# Altium schematic sheet 05_BANK_5_6.SchDoc
size OrCAD B
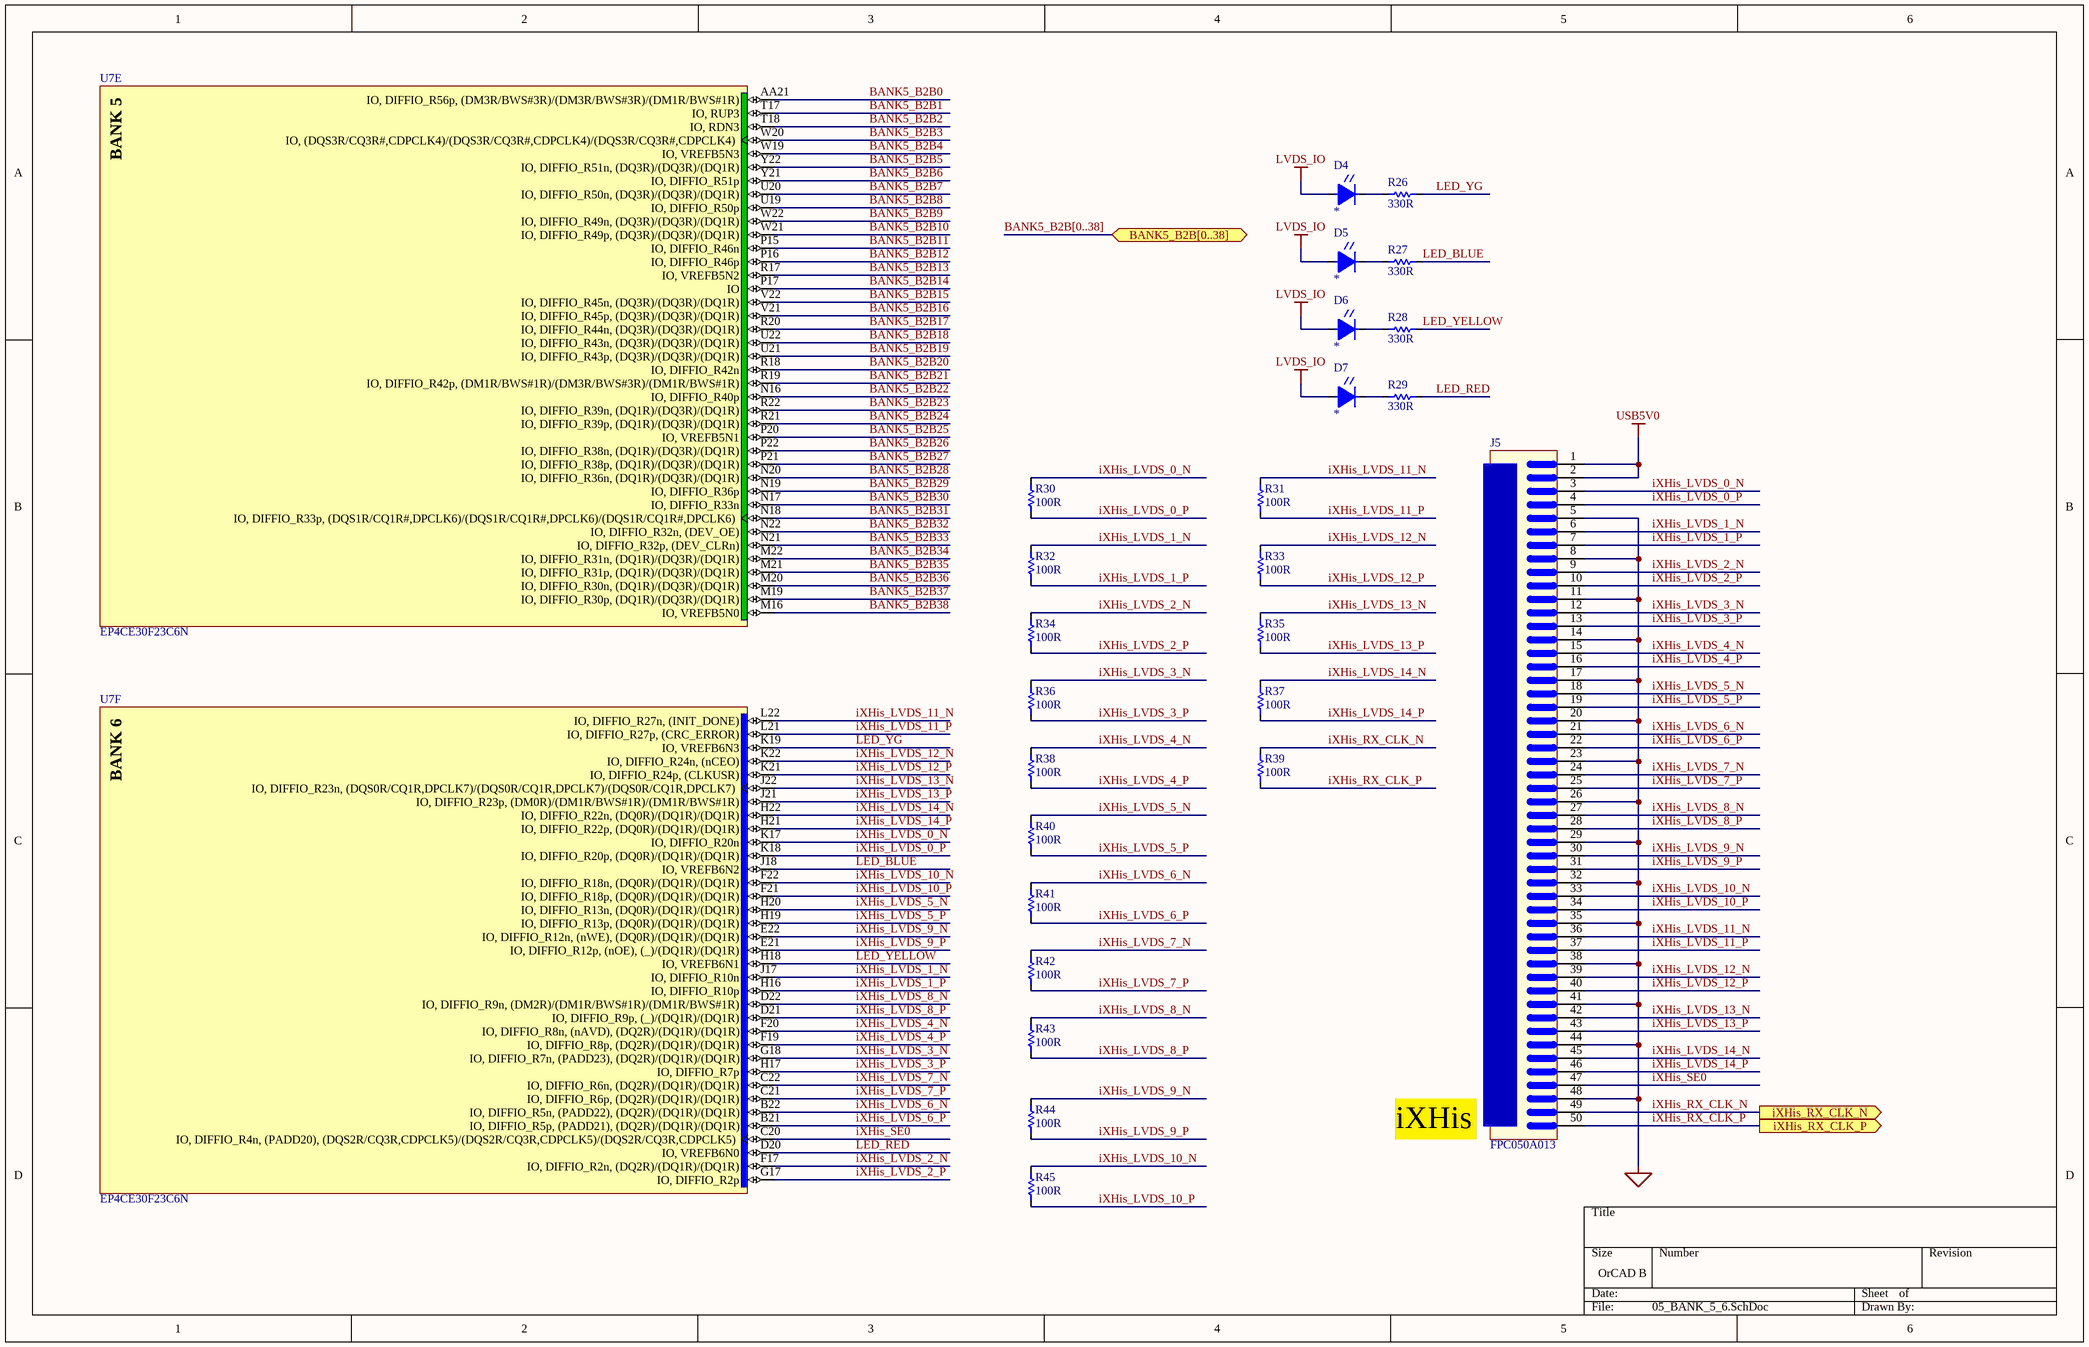
[diagram p0: 05_BANK_5_6.SchDoc]

## Parts
D4  *  [LED0603]
D5  *  [LED0603]
D6  *  [LED0603]
D7  *  [LED0603]
J5  FPC050A013  [FPC050A013]
R26  330R  [R0402]
R27  330R  [R0402]
R28  330R  [R0402]
R29  330R  [R0402]
R30  100R  [R0402]
R31  100R  [R0402]
R32  100R  [R0402]
R33  100R  [R0402]
R34  100R  [R0402]
R35  100R  [R0402]
R36  100R  [R0402]
R37  100R  [R0402]
R38  100R  [R0402]
R39  100R  [R0402]
R40  100R  [R0402]
R41  100R  [R0402]
R42  100R  [R0402]
R43  100R  [R0402]
R44  100R  [R0402]
R45  100R  [R0402]
U7  EP4CE30F23C6N  [FBGA484_EP4CE30F23C6N]  (parts E,F of 13)

## Ports
BANK5_B2B[0..38] (bidir), iXHis_RX_CLK_N (out), iXHis_RX_CLK_P (out)

## Nets
GND: J5.5 J5.8 J5.11 J5.14 J5.17 J5.20 J5.23 J5.26 J5.29 J5.32 J5.35 J5.38 J5.41 J5.44 J5.48
LVDS_IO: D4.1(L20) D5.1(L20) D6.1(L20) D7.1(L20)
USB5V0: J5.1 J5.2
BANK5_B2B0: U7.AA21(IO,_DIFFIO_R56p,_(DM3R/BWS#3R)/(DM3R/BWS#3R)/(DM1R/BWS#1R))
BANK5_B2B1: U7.T17(IO,_RUP3)
BANK5_B2B2: U7.T18(IO,_RDN3)
BANK5_B2B3: U7.W20(IO,_(DQS3R/CQ3R#,CDPCLK4)/(DQS3R/CQ3R#,CDPCLK4)/(DQS3R/CQ3R#,CDPCLK4))
BANK5_B2B4: U7.W19(IO,_VREFB5N3)
BANK5_B2B5: U7.Y22(IO,_DIFFIO_R51n,_(DQ3R)/(DQ3R)/(DQ1R))
BANK5_B2B6: U7.Y21(IO,_DIFFIO_R51p)
BANK5_B2B7: U7.U20(IO,_DIFFIO_R50n,_(DQ3R)/(DQ3R)/(DQ1R))
BANK5_B2B8: U7.U19(IO,_DIFFIO_R50p)
BANK5_B2B9: U7.W22(IO,_DIFFIO_R49n,_(DQ3R)/(DQ3R)/(DQ1R))
BANK5_B2B10: U7.W21(IO,_DIFFIO_R49p,_(DQ3R)/(DQ3R)/(DQ1R))
BANK5_B2B11: U7.P15(IO,_DIFFIO_R46n)
BANK5_B2B12: U7.P16(IO,_DIFFIO_R46p)
BANK5_B2B13: U7.R17(IO,_VREFB5N2)
BANK5_B2B14: U7.P17(IO)
BANK5_B2B15: U7.V22(IO,_DIFFIO_R45n,_(DQ3R)/(DQ3R)/(DQ1R))
BANK5_B2B16: U7.V21(IO,_DIFFIO_R45p,_(DQ3R)/(DQ3R)/(DQ1R))
BANK5_B2B17: U7.R20(IO,_DIFFIO_R44n,_(DQ3R)/(DQ3R)/(DQ1R))
BANK5_B2B18: U7.U22(IO,_DIFFIO_R43n,_(DQ3R)/(DQ3R)/(DQ1R))
BANK5_B2B19: U7.U21(IO,_DIFFIO_R43p,_(DQ3R)/(DQ3R)/(DQ1R))
BANK5_B2B20: U7.R18(IO,_DIFFIO_R42n)
BANK5_B2B21: U7.R19(IO,_DIFFIO_R42p,_(DM1R/BWS#1R)/(DM3R/BWS#3R)/(DM1R/BWS#1R))
BANK5_B2B22: U7.N16(IO,_DIFFIO_R40p)
BANK5_B2B23: U7.R22(IO,_DIFFIO_R39n,_(DQ1R)/(DQ3R)/(DQ1R))
BANK5_B2B24: U7.R21(IO,_DIFFIO_R39p,_(DQ1R)/(DQ3R)/(DQ1R))
BANK5_B2B25: U7.P20(IO,_VREFB5N1)
BANK5_B2B26: U7.P22(IO,_DIFFIO_R38n,_(DQ1R)/(DQ3R)/(DQ1R))
BANK5_B2B27: U7.P21(IO,_DIFFIO_R38p,_(DQ1R)/(DQ3R)/(DQ1R))
BANK5_B2B28: U7.N20(IO,_DIFFIO_R36n,_(DQ1R)/(DQ3R)/(DQ1R))
BANK5_B2B29: U7.N19(IO,_DIFFIO_R36p)
BANK5_B2B30: U7.N17(IO,_DIFFIO_R33n)
BANK5_B2B31: U7.N18(IO,_DIFFIO_R33p,_(DQS1R/CQ1R#,DPCLK6)/(DQS1R/CQ1R#,DPCLK6)/(DQS1R/CQ1R#,DPCLK6))
BANK5_B2B32: U7.N22(IO,_DIFFIO_R32n,_(DEV_OE))
BANK5_B2B33: U7.N21(IO,_DIFFIO_R32p,_(DEV_CLRn))
BANK5_B2B34: U7.M22(IO,_DIFFIO_R31n,_(DQ1R)/(DQ3R)/(DQ1R))
BANK5_B2B35: U7.M21(IO,_DIFFIO_R31p,_(DQ1R)/(DQ3R)/(DQ1R))
BANK5_B2B36: U7.M20(IO,_DIFFIO_R30n,_(DQ1R)/(DQ3R)/(DQ1R))
BANK5_B2B37: U7.M19(IO,_DIFFIO_R30p,_(DQ1R)/(DQ3R)/(DQ1R))
BANK5_B2B38: U7.M16(IO,_VREFB5N0)
iXHis_LVDS_0_N: J5.3 R30.2 U7.K17(IO,_DIFFIO_R20n)
iXHis_LVDS_0_P: J5.4 R30.1 U7.K18(IO,_DIFFIO_R20p,_(DQ0R)/(DQ1R)/(DQ1R))
iXHis_LVDS_1_N: J5.6 R32.2 U7.J17(IO,_DIFFIO_R10n)
iXHis_LVDS_1_P: J5.7 R32.1 U7.H16(IO,_DIFFIO_R10p)
iXHis_LVDS_2_N: J5.9 R34.2 U7.F17(IO,_DIFFIO_R2n,_(DQ2R)/(DQ1R)/(DQ1R))
iXHis_LVDS_2_P: J5.10 R34.1 U7.G17(IO,_DIFFIO_R2p)
iXHis_LVDS_3_N: J5.12 R36.2 U7.G18(IO,_DIFFIO_R7n,_(PADD23),_(DQ2R)/(DQ1R)/(DQ1R))
iXHis_LVDS_3_P: J5.13 R36.1 U7.H17(IO,_DIFFIO_R7p)
iXHis_LVDS_4_N: J5.15 R38.2 U7.F20(IO,_DIFFIO_R8n,_(nAVD),_(DQ2R)/(DQ1R)/(DQ1R))
iXHis_LVDS_4_P: J5.16 R38.1 U7.F19(IO,_DIFFIO_R8p,_(DQ2R)/(DQ1R)/(DQ1R))
iXHis_LVDS_5_N: J5.18 R40.2 U7.H20(IO,_DIFFIO_R13n,_(DQ0R)/(DQ1R)/(DQ1R))
iXHis_LVDS_5_P: J5.19 R40.1 U7.H19(IO,_DIFFIO_R13p,_(DQ0R)/(DQ1R)/(DQ1R))
iXHis_LVDS_6_N: J5.21 R41.2 U7.B22(IO,_DIFFIO_R5n,_(PADD22),_(DQ2R)/(DQ1R)/(DQ1R))
iXHis_LVDS_6_P: J5.22 R41.1 U7.B21(IO,_DIFFIO_R5p,_(PADD21),_(DQ2R)/(DQ1R)/(DQ1R))
iXHis_LVDS_7_N: J5.24 R42.2 U7.C22(IO,_DIFFIO_R6n,_(DQ2R)/(DQ1R)/(DQ1R))
iXHis_LVDS_7_P: J5.25 R42.1 U7.C21(IO,_DIFFIO_R6p,_(DQ2R)/(DQ1R)/(DQ1R))
iXHis_LVDS_8_N: J5.27 R43.2 U7.D22(IO,_DIFFIO_R9n,_(DM2R)/(DM1R/BWS#1R)/(DM1R/BWS#1R))
iXHis_LVDS_8_P: J5.28 R43.1 U7.D21(IO,_DIFFIO_R9p,_(_)/(DQ1R)/(DQ1R))
iXHis_LVDS_9_N: J5.30 R44.2 U7.E22(IO,_DIFFIO_R12n,_(nWE),_(DQ0R)/(DQ1R)/(DQ1R))
iXHis_LVDS_9_P: J5.31 R44.1 U7.E21(IO,_DIFFIO_R12p,_(nOE),_(_)/(DQ1R)/(DQ1R))
iXHis_LVDS_10_N: J5.33 R45.2 U7.F22(IO,_DIFFIO_R18n,_(DQ0R)/(DQ1R)/(DQ1R))
iXHis_LVDS_10_P: J5.34 R45.1 U7.F21(IO,_DIFFIO_R18p,_(DQ0R)/(DQ1R)/(DQ1R))
iXHis_LVDS_11_N: J5.36 R31.2 U7.L22(IO,_DIFFIO_R27n,_(INIT_DONE))
iXHis_LVDS_11_P: J5.37 R31.1 U7.L21(IO,_DIFFIO_R27p,_(CRC_ERROR))
iXHis_LVDS_12_N: J5.39 R33.2 U7.K22(IO,_DIFFIO_R24n,_(nCEO))
iXHis_LVDS_12_P: J5.40 R33.1 U7.K21(IO,_DIFFIO_R24p,_(CLKUSR))
iXHis_LVDS_13_N: J5.42 R35.2 U7.J22(IO,_DIFFIO_R23n,_(DQS0R/CQ1R,DPCLK7)/(DQS0R/CQ1R,DPCLK7)/(DQS0R/CQ1R,DPCLK7))
iXHis_LVDS_13_P: J5.43 R35.1 U7.J21(IO,_DIFFIO_R23p,_(DM0R)/(DM1R/BWS#1R)/(DM1R/BWS#1R))
iXHis_LVDS_14_N: J5.45 R37.2 U7.H22(IO,_DIFFIO_R22n,_(DQ0R)/(DQ1R)/(DQ1R))
iXHis_LVDS_14_P: J5.46 R37.1 U7.H21(IO,_DIFFIO_R22p,_(DQ0R)/(DQ1R)/(DQ1R))
iXHis_RX_CLK_N: J5.49 R39.2 ; port iXHis_RX_CLK_N
iXHis_RX_CLK_P: J5.50 R39.1 ; port iXHis_RX_CLK_P
iXHis_SE0: J5.47 U7.C20(IO,_DIFFIO_R4n,_(PADD20),_(DQS2R/CQ3R,CDPCLK5)/(DQS2R/CQ3R,CDPCLK5)/(DQS2R/CQ3R,CDPCLK5))
LED_BLUE: R27.2 U7.J18(IO,_VREFB6N2)
LED_RED: R29.2 U7.D20(IO,_VREFB6N0)
LED_YELLOW: R28.2 U7.H18(IO,_VREFB6N1)
LED_YG: R26.2 U7.K19(IO,_VREFB6N3)
NetD4_2: D4.2(L21) R26.1
NetD5_2: D5.2(L21) R27.1
NetD6_2: D6.2(L21) R28.1
NetD7_2: D7.2(L21) R29.1

## Buses and harness runs
bus BANK5_B2B[0..38] = port BANK5_B2B[0..38]

## Notes on the sheet
- iXHis
- (in symbol EP4CE30F23C6N, part E) BANK 5
- (in symbol EP4CE30F23C6N, part F) BANK 6

## Library data of the parts
D4 = LED YellowGreen0603: LED,Yellow Green,2V,20mA,0603; Manufacturer1: *; PartNumberManufacturer2: *; Manufacturer2: *; PartNumberManufacturer1: *; UnitPrice: *
D5 = LED Blue0603: LED,Blue,3.4V,20mA,0603; Manufacturer1: *; PartNumberManufacturer2: *; Manufacturer2: *; PartNumberManufacturer1: *; UnitPrice: *
D6 = LED Yellow0603: LED,Yellow,2V,20mA,0603; Manufacturer1: *; PartNumberManufacturer2: *; Manufacturer2: *; PartNumberManufacturer1: *; UnitPrice: *
D7 = LED SuperRed0603: LED,Super Red,2V,20mA,0603; Manufacturer1: *; PartNumberManufacturer2: *; Manufacturer2: *; PartNumberManufacturer1: *; UnitPrice: *
J5 = FPC0.5mm_05: FFC socket,50-Pin,Vertical,0.5mm Pitch,SMD; Manufacturer1: XinHongNuo; Manufacturer2: *; PartNumberManufacturer1: FPC050A013; PartNumberManufacturer2: *; UnitPrice: *
R26-R29 = RES0111: RES,330R,1%,1/16W,0402; Manufacturer1: *; PartNumberManufacturer2: *; Manufacturer2: *; PartNumberManufacturer1: *; Value: 330R; UnitPrice: *
R30-R45 = RES019: RES,100R,1%,1/16W,0402; Manufacturer1: *; PartNumberManufacturer2: *; Manufacturer2: *; PartNumberManufacturer1: *; Value: 100R; UnitPrice: *
U7 = EP4CE30F23C6N: IC,FPGA,28848 LEs,Speed-6,FBGA484; Manufacturer1: ALTERA; PartNumberManufacturer1: EP4CE30F23C6N; UnitPrice: *; PartNumberManufacturer2: *; Manufacturer2: *